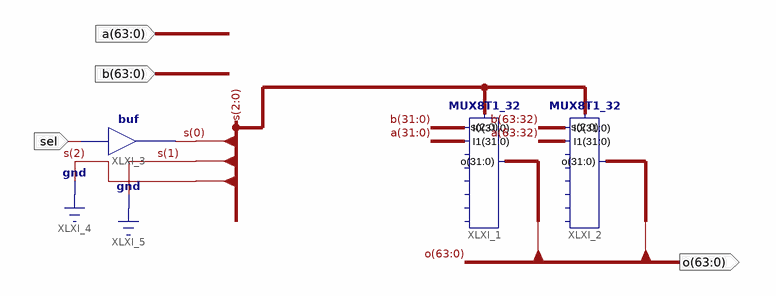
[diagram p0: schematic sheet 1]
// Xilinx ISE schematic MUX2T1_64.sch (kintex7) as structural Verilog: 3 symbols, 4 ports
module MUX2T1_64 (
  input  [63:0] a,
  input  [63:0] b,
  input  sel,
  output [63:0] o
);

  wire [0:0] s;

  MUX8T1_32 XLXI_1 (.s({2'b00, s[0]}), .I1(a[31:0]), .I0(b[31:0]), .o(o[31:0]));  // open: I7, I6, I5, I4, I3, I2
  MUX8T1_32 XLXI_2 (.s({2'b00, s[0]}), .I1(a[63:32]), .I0(b[63:32]), .o(o[63:32]));  // open: I7, I6, I5, I4, I3, I2
  buf XLXI_3 (s[0], sel);
endmodule
